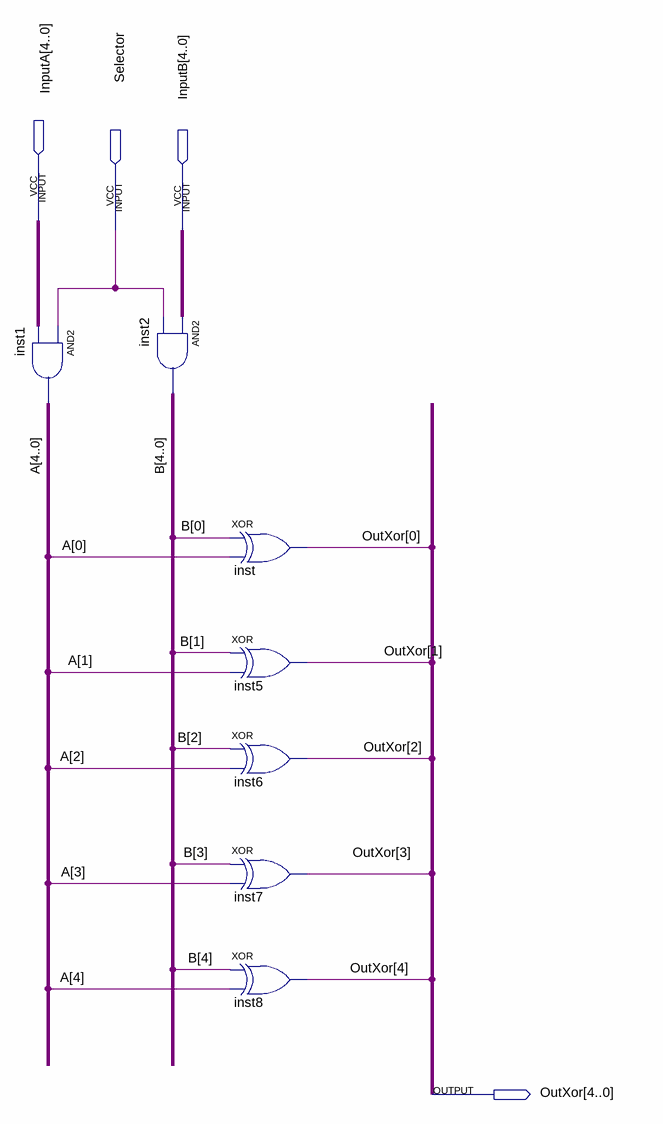
[diagram p0: schematic sheet]
// Quartus schematic XorGate.bdf as structural Verilog: 7 symbols, 4 pins
module XorGate (
  input  [4:0] InputA,
  input  Selector,
  input  [4:0] InputB,
  output [4:0] OutXor
);

  wire [4:0] A, B;

  assign A = {5{Selector}} & InputA;  // AND2 inst1, 5 bits wide
  assign B = InputB & {5{Selector}};  // AND2 inst2, 5 bits wide
  xor inst (OutXor[0], B[0], A[0]);
  xor inst5 (OutXor[1], B[1], A[1]);
  xor inst6 (OutXor[2], B[2], A[2]);
  xor inst7 (OutXor[3], B[3], A[3]);
  xor inst8 (OutXor[4], B[4], A[4]);
endmodule
